# Altium schematic sheet MCU.SchDoc
size A4
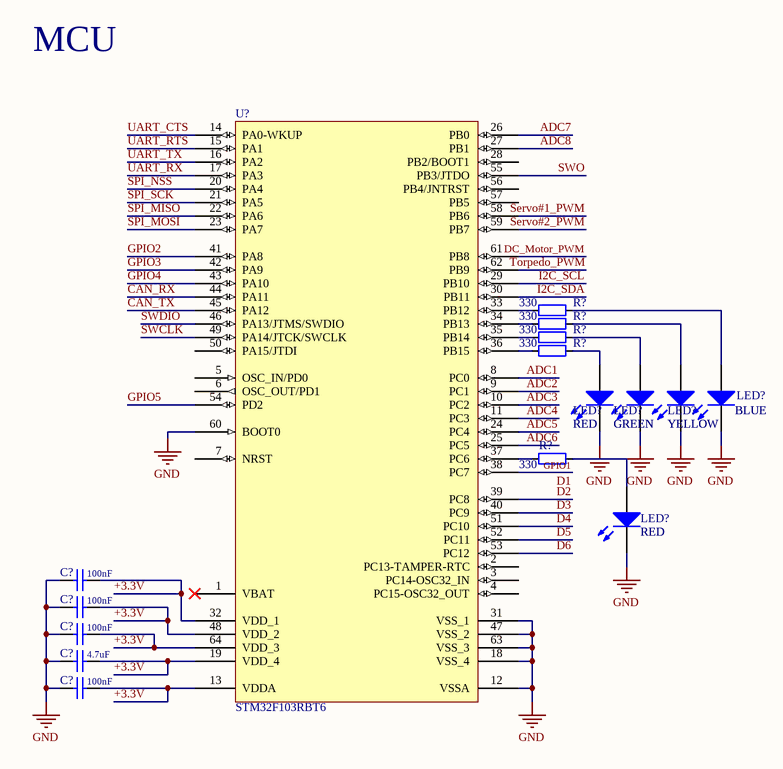
[diagram p0: MCU.SchDoc]

## Parts
(Parts that share a designator on the sheet are numbered #1, #2 ... from top to bottom, then left to right.)
C?#1  value 100nF  [0603_CAP]  (hidden comment: Cap)
C?#2  value 100nF  [0603_CAP]  (hidden comment: Cap)
C?#3  value 100nF  [0603_CAP]  (hidden comment: Cap)
C?#4  value 4.7uF  [0603_CAP]  (hidden comment: Cap)
C?#5  value 100nF  [0603_CAP]  (hidden comment: Cap)
LED?#1  RED  [LED_THT_RED]
LED?#2  GREEN  [LED_THT_YELLOW]
LED?#3  YELLOW  [LED_THT_GREEN]
LED?#4  BLUE  [LED_THT_BLUE]
LED?#5  RED  [LED_THT_RED]
R?#1  330  [0603]
R?#2  330  [0603]
R?#3  330  [0603]
R?#4  330  [0603]
R?#5  330  [0603]
U?  STM32F103RBT6  [LQFP64_L]

## Nets
GND: C?#1.1 C?#2.1 C?#3.1 C?#4.1 C?#5.1 LED?#1.2(K) LED?#2.2(K) LED?#3.2(K) LED?#4.2(K) LED?#5.2(K) U?.12(VSSA) U?.18(VSS_4) U?.31(VSS_1) U?.47(VSS_2) U?.60(BOOT0) U?.63(VSS_3)
+3.3V: C?#1.2 C?#2.2 C?#3.2 C?#4.2 C?#5.2 U?.13(VDDA) U?.19(VDD_4) U?.32(VDD_1) U?.48(VDD_2) U?.64(VDD_3)
ADC1: U?.8(PC0)
ADC2: U?.9(PC1)
ADC3: U?.10(PC2)
ADC4: U?.11(PC3)
ADC5: U?.24(PC4)
ADC6: U?.25(PC5)
ADC7: U?.26(PB0)
ADC8: U?.27(PB1)
CAN_RX: U?.44(PA11)
CAN_TX: U?.45(PA12)
D1: U?.38(PC7)  [also labelled GPIO1]
D2: U?.39(PC8)
D3: U?.40(PC9)
D4: U?.51(PC10)
D5: U?.52(PC11)
D6: U?.53(PC12)
DC_Motor_PWM: U?.61(PB8)
GPIO2: U?.41(PA8)
GPIO3: U?.42(PA9)
GPIO4: U?.43(PA10)
GPIO5: U?.54(PD2)
I2C_SCL: U?.29(PB10)
I2C_SDA: U?.30(PB11)
Servo#1_PWM: U?.58(PB6)
Servo#2_PWM: U?.59(PB7)
SPI_MISO: U?.22(PA6)
SPI_MOSI: U?.23(PA7)
SPI_NSS: U?.20(PA4)
SPI_SCK: U?.21(PA5)
SWCLK: U?.49(PA14/JTCK/SWCLK)
SWDIO: U?.46(PA13/JTMS/SWDIO)
SWO: U?.55(PB3/JTDO)
Torpedo_PWM: U?.62(PB9)
UART_CTS: U?.14(PA0-WKUP)
UART_RTS: U?.15(PA1)
UART_RX: U?.17(PA3)
UART_TX: U?.16(PA2)
NetLED?#1_1: LED?#1.1(A) R?#4.2
NetLED?#2_1: LED?#2.1(A) R?#3.2
NetLED?#3_1: LED?#3.1(A) R?#2.2
NetLED?#4_1: LED?#4.1(A) R?#1.2
NetLED?#5_1: LED?#5.1(A) R?#5.2
NetR?#1_1: R?#1.1 U?.33(PB12)
NetR?#2_1: R?#2.1 U?.34(PB13)
NetR?#3_1: R?#3.1 U?.35(PB14)
NetR?#4_1: R?#4.1 U?.36(PB15)
NetR?#5_1: R?#5.1 U?.37(PC6)

Not connected (* = marked no-connect by the designer): U? 1(VBAT)* 2(PC13-TAMPER-RTC) 3(PC14-OSC32_IN) 4(PC15-OSC32_OUT) 5(OSC_IN/PD0) 6(OSC_OUT/PD1) 7(NRST) 28(PB2/BOOT1) 50(PA15/JTDI) 56(PB4/JNTRST) 57(PB5)

## Notes on the sheet
- MCU

## Library data of the parts
C?#1-C?#5 = Cap: Ceramic capacitor; Unit Price1: *; Unit Price2: *
LED?#1-LED?#5 = LED: Light-emitting diode
  LED?#1 LED?#5: COLOR: RED
  LED?#2: COLOR: GREEN
  LED?#3: COLOR: YELLOW
  LED?#4: COLOR: BLUE
R?#1-R?#5 = RES: Resistior; Value: 330
U? = STM32F103RBT6: STM32 ARM-based 32-bit; Published: 30-May-2008; DatasheetVersion: rev6, Mar-2008; PackageVersion: Mar-2008; PackageReference: LQFP64; Publisher: Altium Limited; PackageDescription: 64-Pin Low-Profile Quad Flat Pack, 10 x 10 mm Body, 0.5 mm Pitch (LQFP64); ComponentLink1Description: Manufacturer Link; ComponentLink1URL: www.st.com/stm32; ComponentLink2Description: Datasheet; ComponentLink2URL: http://www.st.com/stonline/products/literature/ds/13587.pdf